# Altium schematic sheet Sheet5.SchDoc
size A4
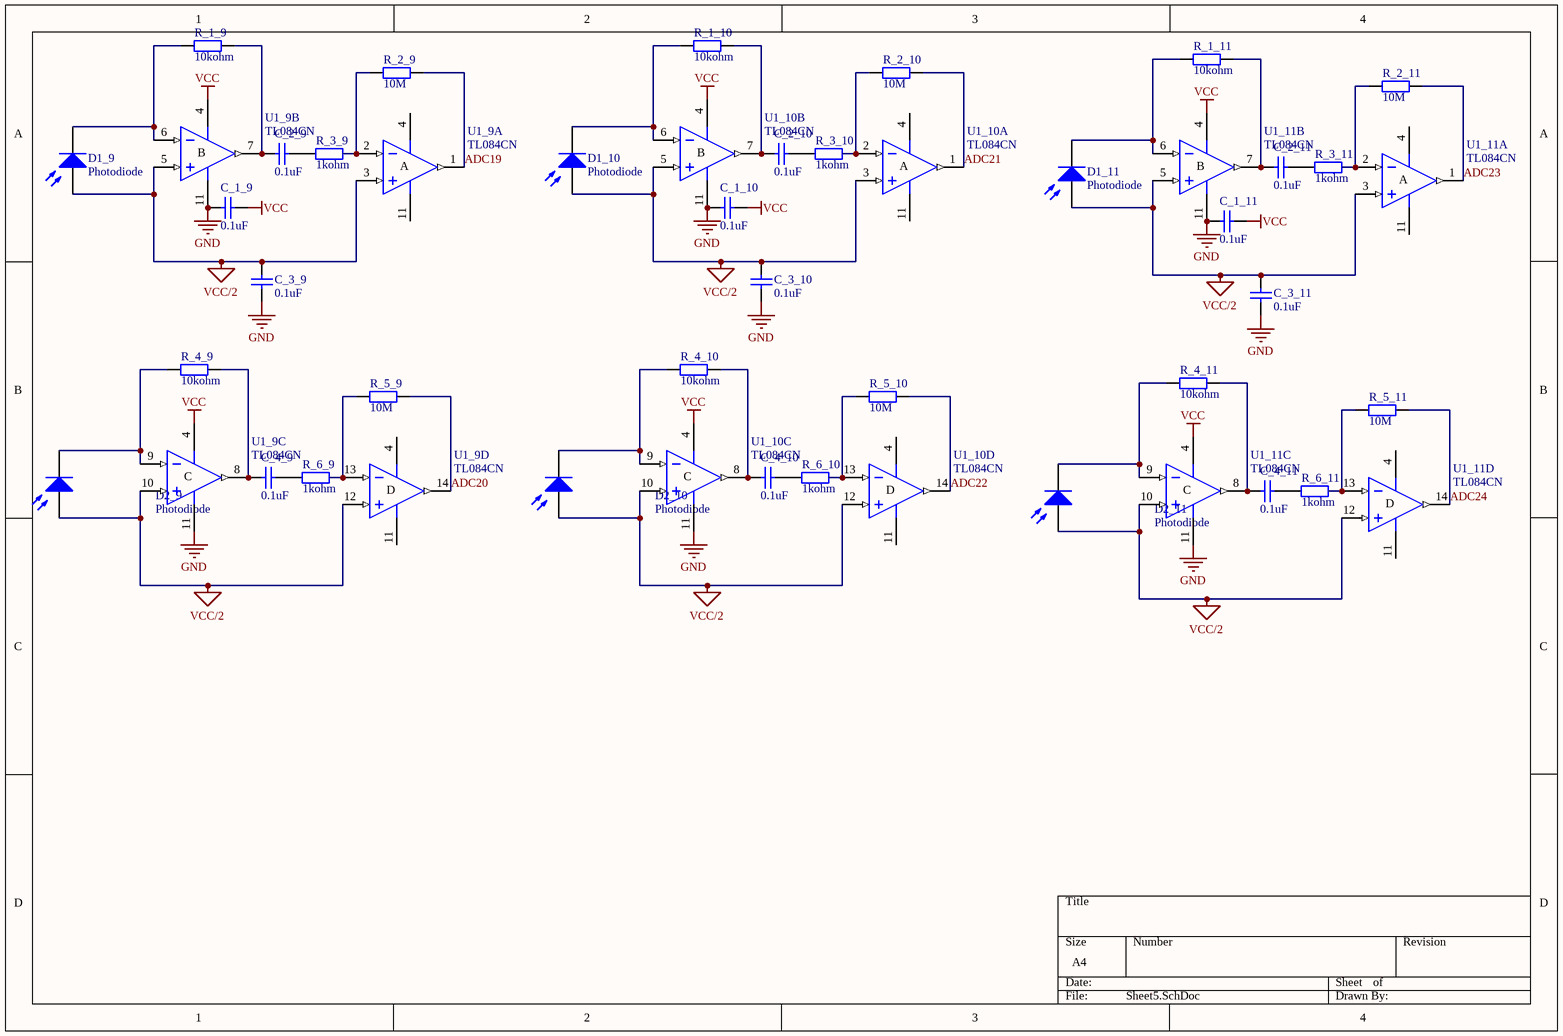
[diagram p0: Sheet5.SchDoc]

## Parts
C_1_9  0.1uF  [cms805 - mini]
C_1_10  0.1uF  [cms805 - mini]
C_1_11  0.1uF  [cms805 - mini]
C_2_9  0.1uF  [cms805 - mini]
C_2_10  0.1uF  [cms805 - mini]
C_2_11  0.1uF  [cms805 - mini]
C_3_9  0.1uF  [cms805 - mini]
C_3_10  0.1uF  [cms805 - mini]
C_3_11  0.1uF  [cms805 - mini]
C_4_9  0.1uF  [cms805 - mini]
C_4_10  0.1uF  [cms805 - mini]
C_4_11  0.1uF  [cms805 - mini]
D1_9  Photodiode  [TEMD1000]
D1_10  Photodiode  [TEMD1000]
D1_11  Photodiode  [TEMD1000]
D2_9  Photodiode  [TEMD1000]
D2_10  Photodiode  [TEMD1000]
D2_11  Photodiode  [TEMD1000]
R_1_9  10kohm  [cms805 - mini]
R_1_10  10kohm  [cms805 - mini]
R_1_11  10kohm  [cms805 - mini]
R_2_9  10M  [cms805 - mini]
R_2_10  10M  [cms805 - mini]
R_2_11  10M  [cms805 - mini]
R_3_9  1kohm  [cms805 - mini]
R_3_10  1kohm  [cms805 - mini]
R_3_11  1kohm  [cms805 - mini]
R_4_9  10kohm  [cms805 - mini]
R_4_10  10kohm  [cms805 - mini]
R_4_11  10kohm  [cms805 - mini]
R_5_9  10M  [cms805 - mini]
R_5_10  10M  [cms805 - mini]
R_5_11  10M  [cms805 - mini]
R_6_9  1kohm  [cms805 - mini]
R_6_10  1kohm  [cms805 - mini]
R_6_11  1kohm  [cms805 - mini]
U1_9  TL084CN  [TSSOP14]  (parts A,B,C,D of 4)
U1_10  TL084CN  [TSSOP14]  (parts A,B,C,D of 4)
U1_11  TL084CN  [TSSOP14]  (parts A,B,C,D of 4)

## Nets
GND: C_1_9.1 C_1_10.1 C_1_11.1 C_3_9.1 C_3_10.1 C_3_11.1 U1_9.11(V-) U1_10.11(V-) U1_11.11(V-)
VCC: C_1_9.2 C_1_10.2 C_1_11.2 U1_9.4(V+) U1_10.4(V+) U1_11.4(V+)
VCC/2: C_3_9.2 C_3_10.2 C_3_11.2 D1_9.1(A) D1_10.1(A) D1_11.1(A) D2_9.1(A) D2_10.1(A) D2_11.1(A) U1_9.3(IN+) U1_9.5(IN+) U1_9.10(IN+) U1_9.12(IN+) U1_10.3(IN+) U1_10.5(IN+) U1_10.10(IN+) U1_10.12(IN+) U1_11.3(IN+) U1_11.5(IN+) U1_11.10(IN+) U1_11.12(IN+)
ADC19: R_2_9.2 U1_9.1(OUT)
ADC20: R_5_9.2 U1_9.14(OUT)
ADC21: R_2_10.2 U1_10.1(OUT)
ADC22: R_5_10.2 U1_10.14(OUT)
ADC23: R_2_11.2 U1_11.1(OUT)
ADC24: R_5_11.2 U1_11.14(OUT)
NetC_2_9_1: C_2_9.1 R_3_9.1
NetC_2_9_2: C_2_9.2 R_1_9.2 U1_9.7(OUT)
NetC_2_10_1: C_2_10.1 R_3_10.1
NetC_2_10_2: C_2_10.2 R_1_10.2 U1_10.7(OUT)
NetC_2_11_1: C_2_11.1 R_3_11.1
NetC_2_11_2: C_2_11.2 R_1_11.2 U1_11.7(OUT)
NetC_4_9_1: C_4_9.1 R_6_9.1
NetC_4_9_2: C_4_9.2 R_4_9.2 U1_9.8(OUT)
NetC_4_10_1: C_4_10.1 R_6_10.1
NetC_4_10_2: C_4_10.2 R_4_10.2 U1_10.8(OUT)
NetC_4_11_1: C_4_11.1 R_6_11.1
NetC_4_11_2: C_4_11.2 R_4_11.2 U1_11.8(OUT)
NetD1_9_2: D1_9.2(K) R_1_9.1 U1_9.6(IN-)
NetD1_10_2: D1_10.2(K) R_1_10.1 U1_10.6(IN-)
NetD1_11_2: D1_11.2(K) R_1_11.1 U1_11.6(IN-)
NetD2_9_2: D2_9.2(K) R_4_9.1 U1_9.9(IN-)
NetD2_10_2: D2_10.2(K) R_4_10.1 U1_10.9(IN-)
NetD2_11_2: D2_11.2(K) R_4_11.1 U1_11.9(IN-)
NetR_2_9_1: R_2_9.1 R_3_9.2 U1_9.2(IN-)
NetR_2_10_1: R_2_10.1 R_3_10.2 U1_10.2(IN-)
NetR_2_11_1: R_2_11.1 R_3_11.2 U1_11.2(IN-)
NetR_5_9_1: R_5_9.1 R_6_9.2 U1_9.13(IN-)
NetR_5_10_1: R_5_10.1 R_6_10.2 U1_10.13(IN-)
NetR_5_11_1: R_5_11.1 R_6_11.2 U1_11.13(IN-)

## Notes on the sheet
- (in symbol TL084CN, part A) A
- (in symbol TL084CN, part B) B
- (in symbol TL084CN, part C) C
- (in symbol TL084CN, part D) D

## Library data of the parts
C_1_9-C_1_11 C_2_9-C_2_11 C_3_9-C_3_11 C_4_9-C_4_11 = Capa
R_1_9-R_1_11 R_2_9-R_2_11 R_3_9-R_3_11 R_4_9-R_4_11 R_5_9-R_5_11 R_6_9-R_6_11 = Resistance
U1_9-U1_11 = TL084CN: General-Purpose J-FET Quad Operational Amplifier; Published: 24-Aug-2001; LatestRevisionDate: 06-Jun-2005; LatestRevisionNote: Stylized 3D Model Added.; DatasheetVersion: Jan-1999; PackageVersion: Jan-1997; PackageReference: DIP14; Publisher: Altium Limited; PackageDescription: DIP; 14 Leads; Row Spacing 7.62 mm; Pitch 2.54 mm; ComponentLink1Description: Manufacturer Link; ComponentLink1URL: http://www.st.com/; ComponentLink2Description: Datasheet; ComponentLink2URL: http://www.st.com/stonline/products/literature/ds/2301/tl084.pdf
D1_9-D1_11 D2_9-D2_11 = Photodiode: Published: 24-Mar-1999; LatestRevisionDate: 17-Jul-2002; LatestRevisionNote: Re-released for DXP Platform.; PackageReference: PIN2; Publisher: Altium Limited